# Altium schematic sheet SensorBoardTAOS.SchDoc
size A
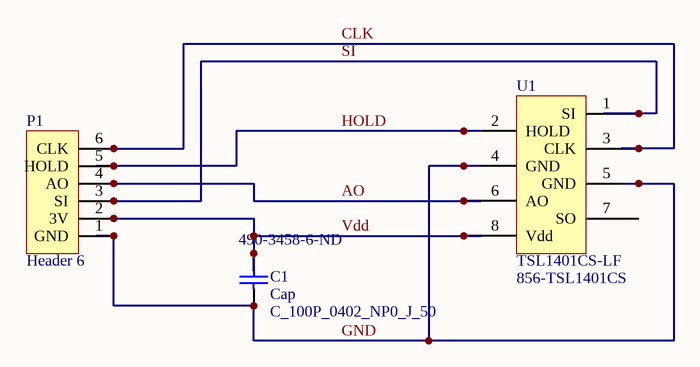
[diagram p0: SensorBoardTAOS.SchDoc]

## Parts
C1  Cap  value C_100P_0402_NP0_J_50  Supplier Part Number 1: 490-3458-6-ND  [C_0402]
P1  Header 6  [CARD EDGE 6 PIN 3X2]
U1  TSL1401CS-LF  Supplier Part Number 1: 856-TSL1401CS  [TSL1401CS-LF solder bump linear array]

## Nets
AO: P1.4(AO) U1.6(AO)
CLK: P1.6(CLK) U1.3(CLK)
GND: C1.1 P1.1(GND) U1.4(GND) U1.5(GND)
HOLD: P1.5(HOLD) U1.2(HOLD)
SI: P1.3(SI) U1.1(SI)
Vdd: C1.2 P1.2(3V) U1.8(Vdd)

Not connected (* = marked no-connect by the designer): U1 7(SO)

## Library data of the parts
C1 = Cap: Capacitor; Published: 8-Jun-2000; LatestRevisionDate: 17-Jul-2002; LatestRevisionNote: Re-released for DXP Platform.; PackageReference: RAD-0.3; Publisher: Altium Limited; PackageDescription: Radial Cap, Thru-Hole; 2 Leads; 0.3 in Pin Spacing; Supplier 1: Digi-Key
P1 = Header 6: Card Edge Connector, 6-Pin; LatestRevisionDate: 17-Jul-2002; LatestRevisionNote: Re-released for DXP Platform.; Publisher: Altium Limited
U1 = TSL1401CS-LF: Supplier 1: Mouser